# EAGLE schematic BLDC_controller_0 (EAGLE 9.4.1)
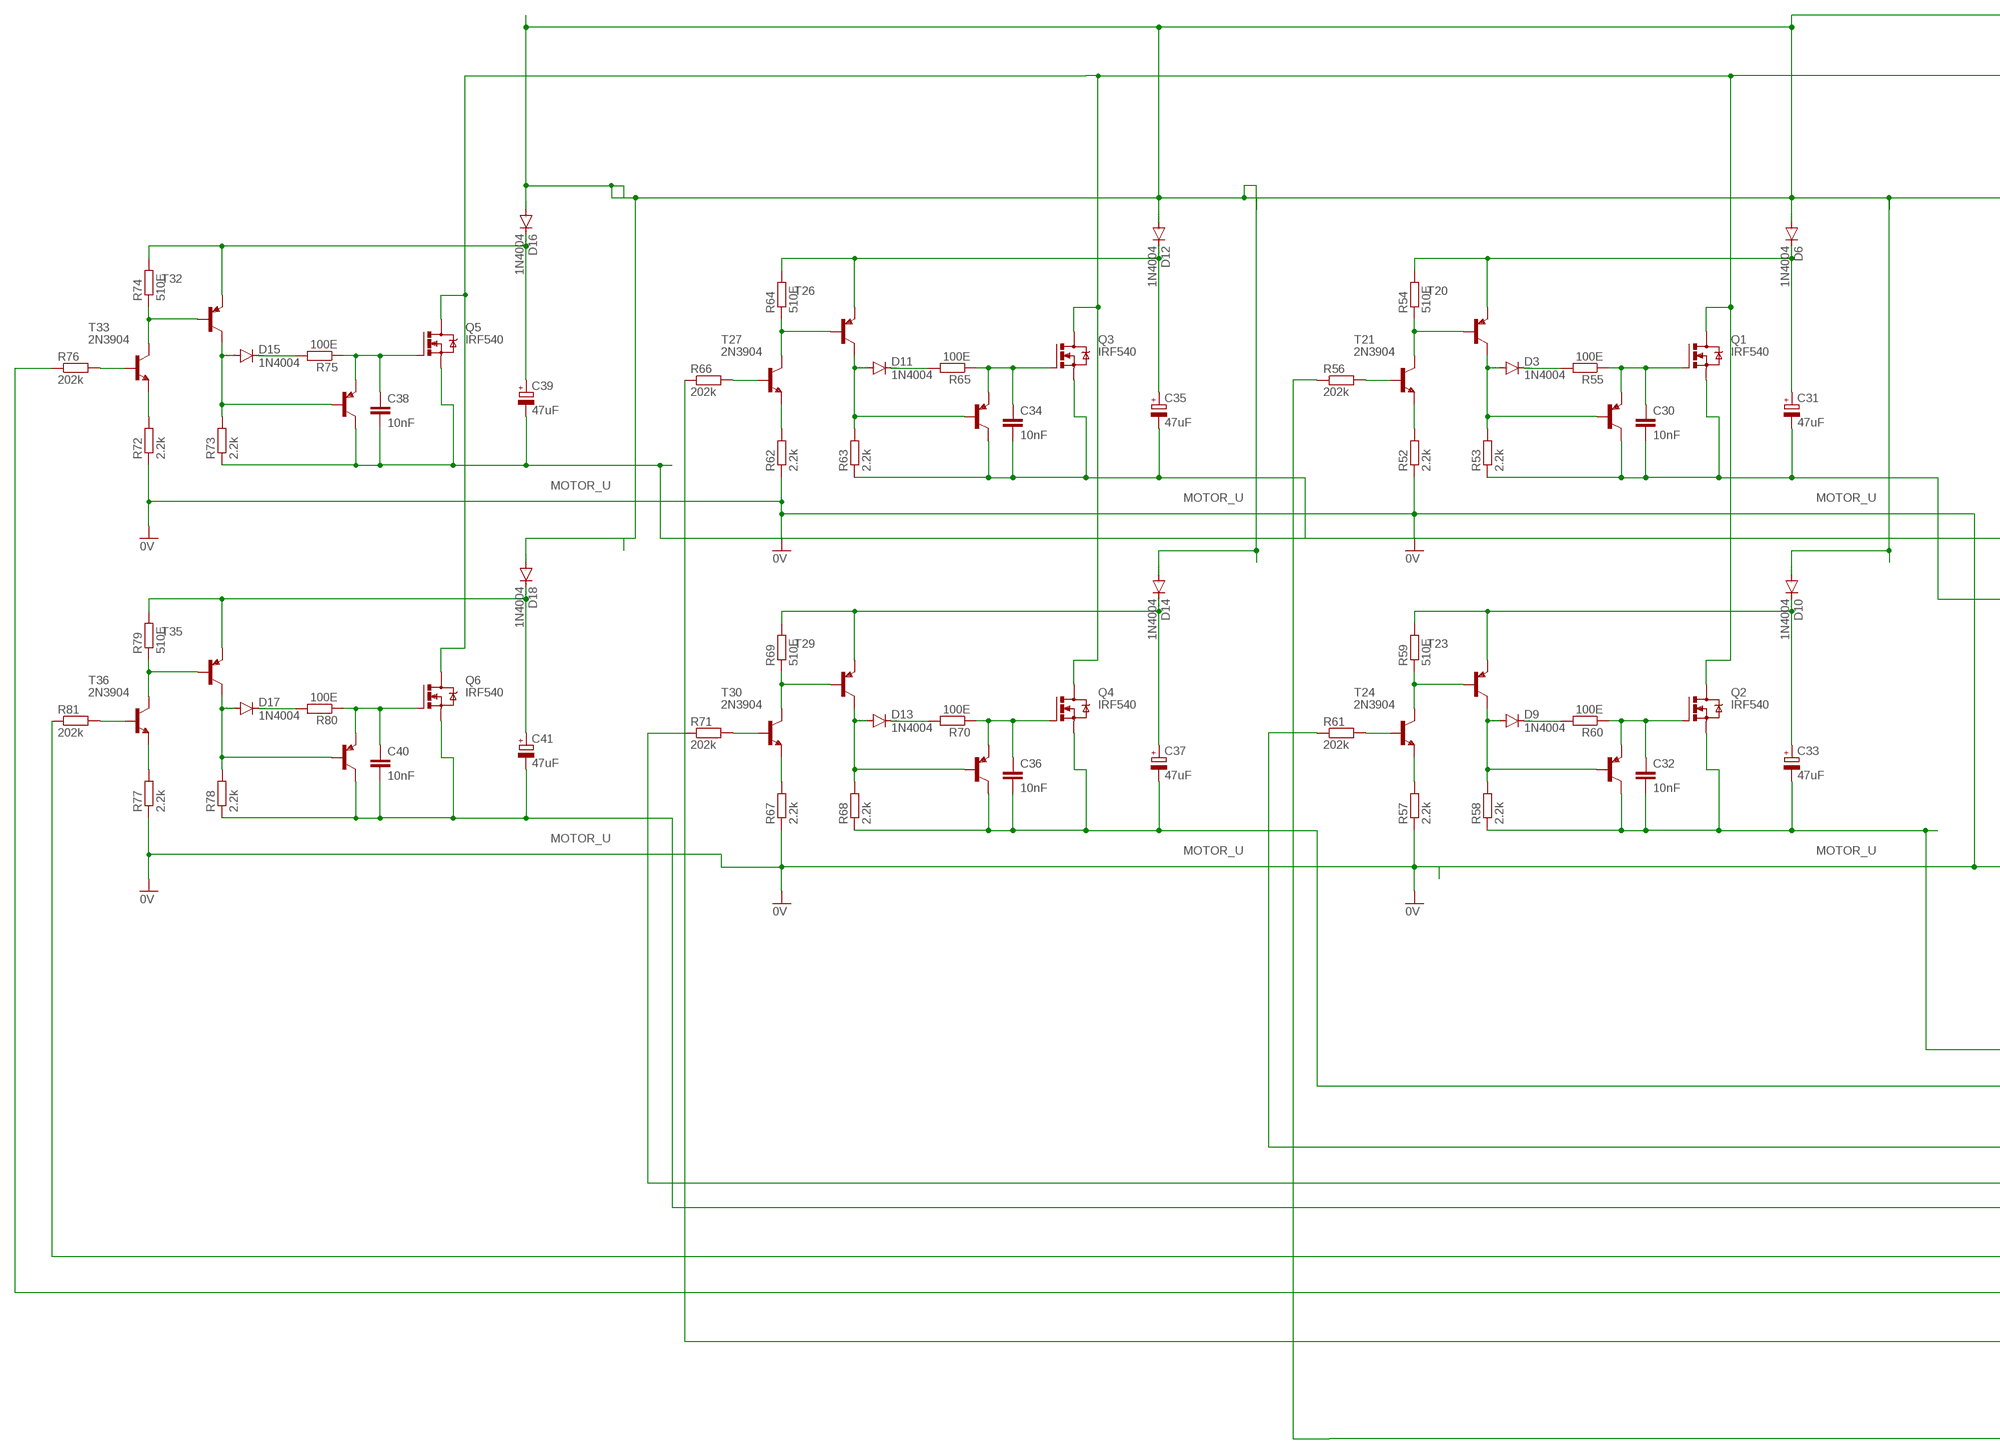
[diagram p0: schematic, sheet 1, part 1 of 3]
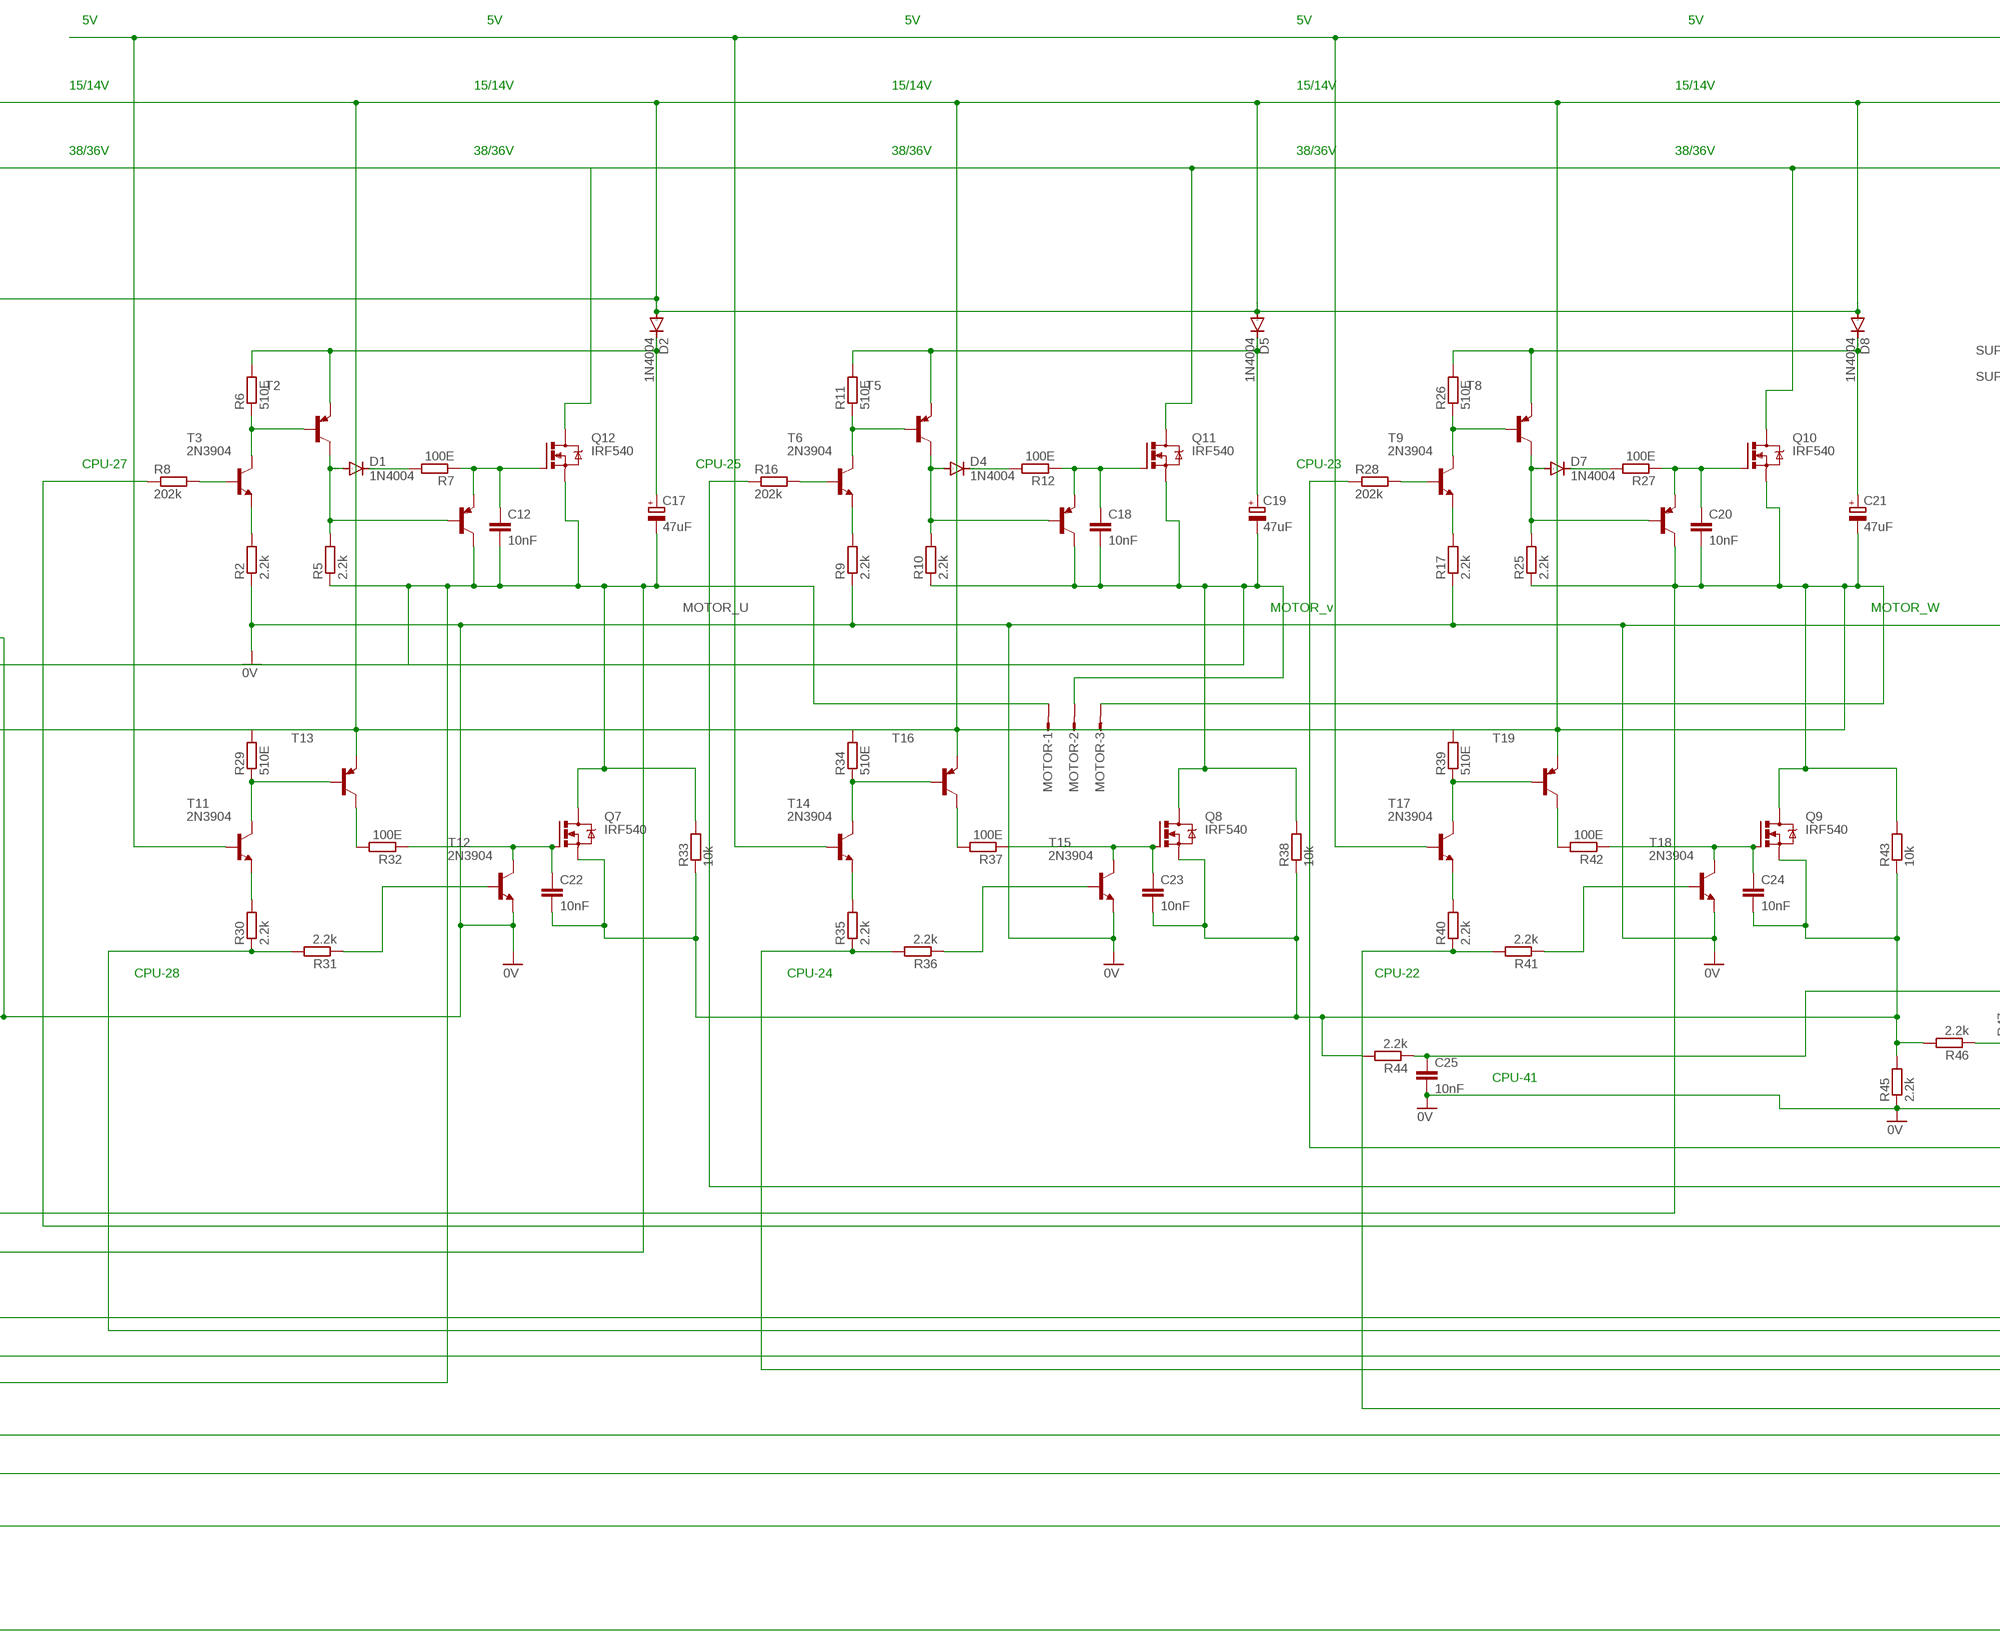
[diagram p1: schematic, sheet 1, part 2 of 3]
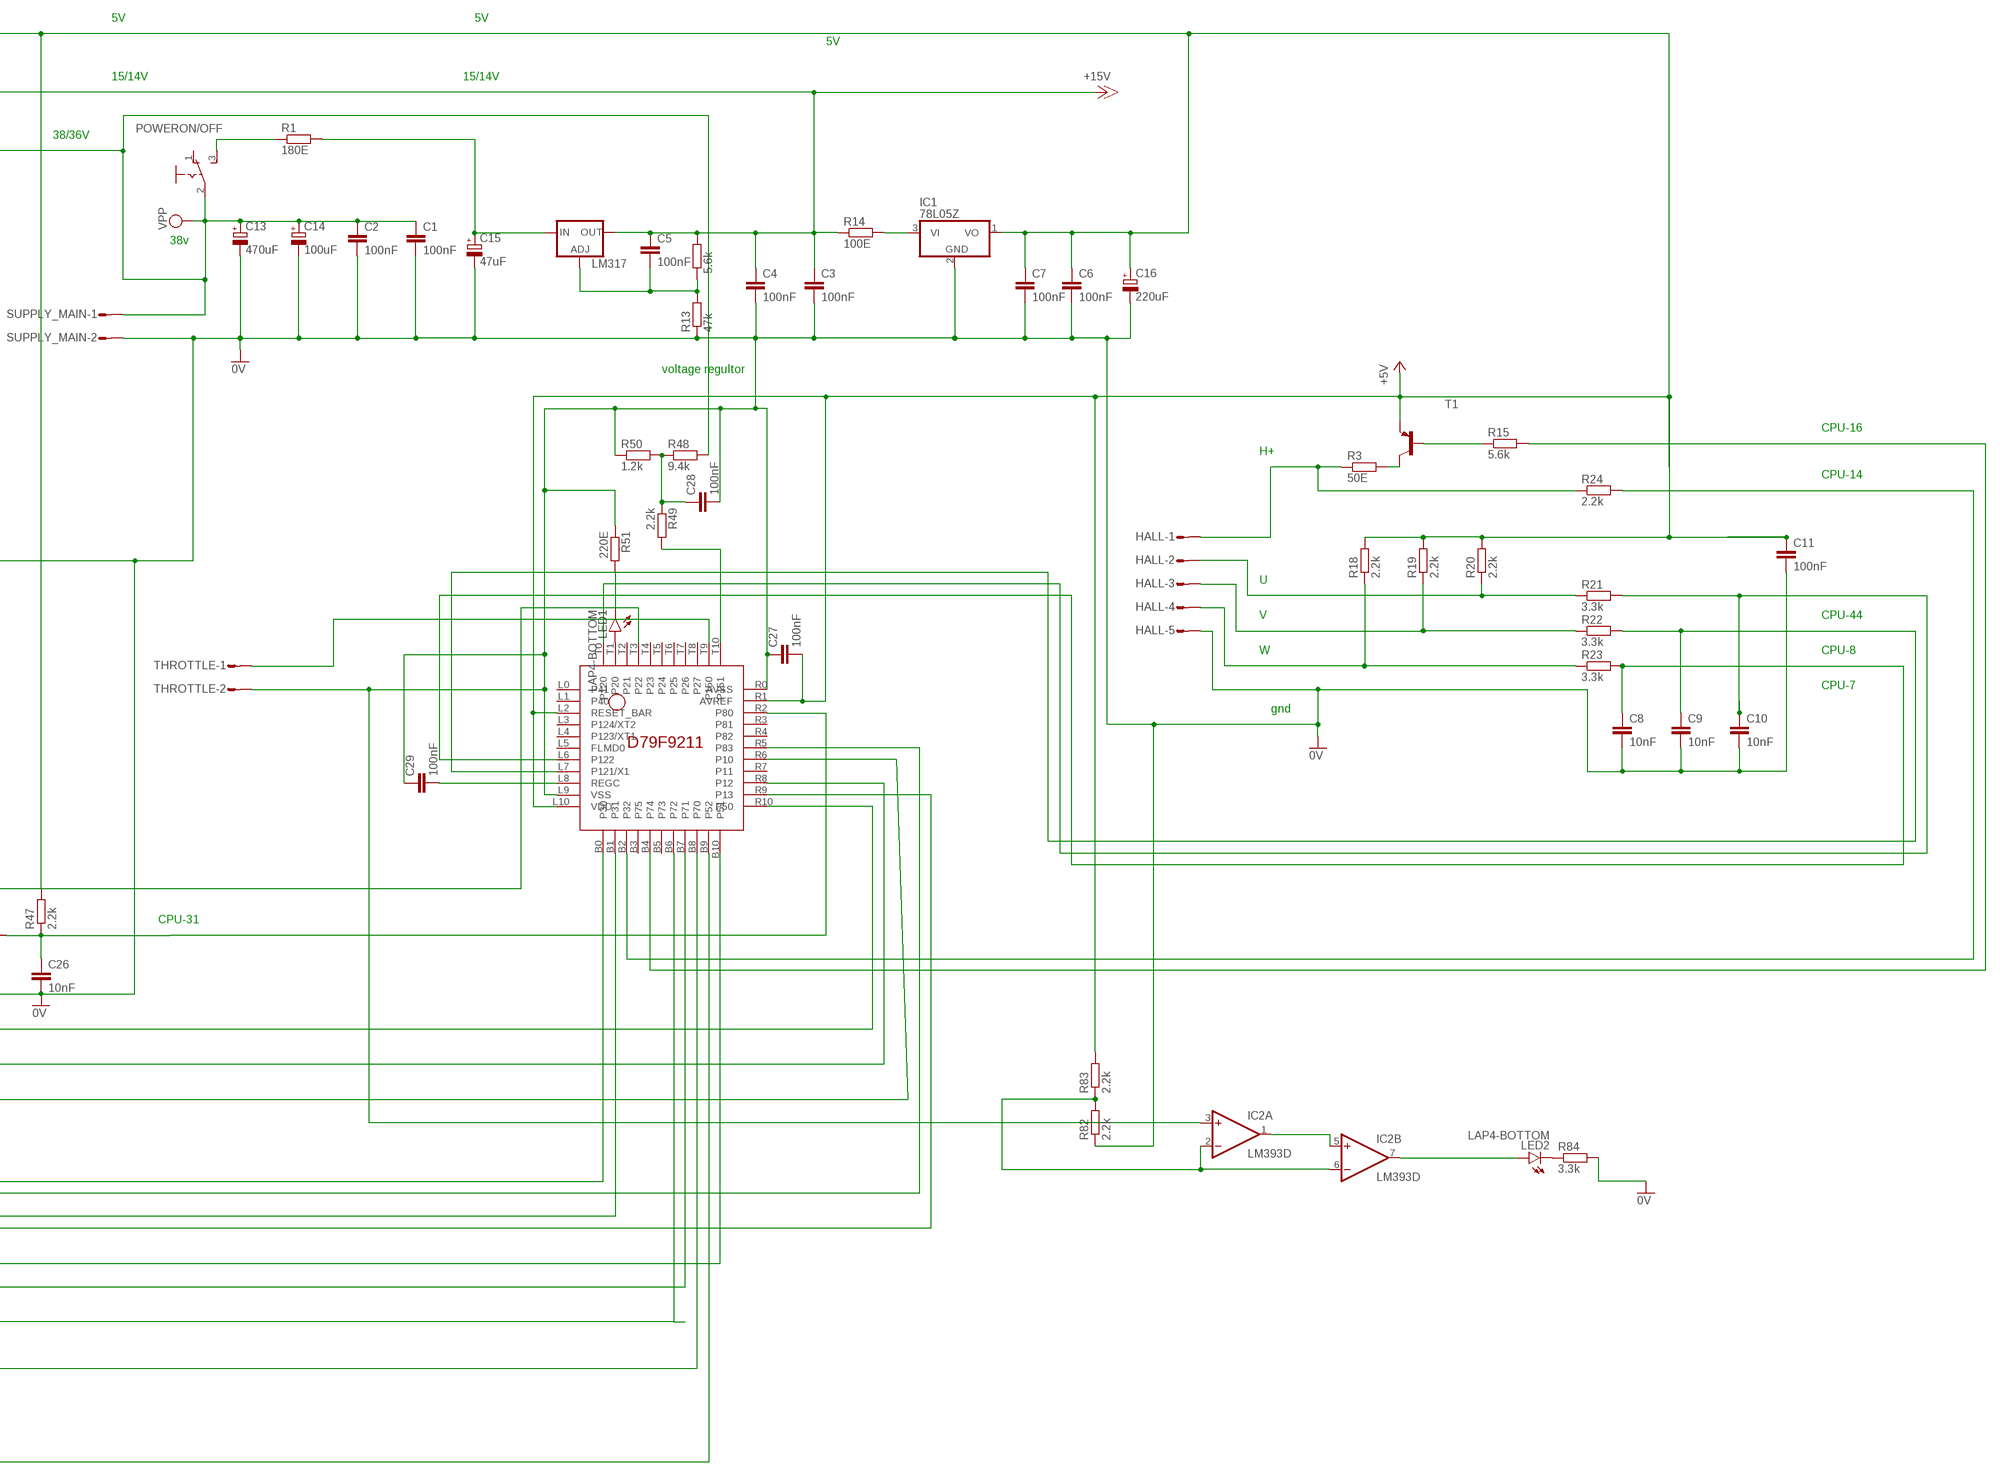
[diagram p2: schematic, sheet 1, part 3 of 3]

## Parts
C1  100nF  C-EU025-024X044  [C025-024X044]
C2  100nF  C-EU025-024X044  [C025-024X044]
C3  100nF  C-EU025-024X044  [C025-024X044]
C4  100nF  C-EU025-024X044  [C025-024X044]
C5  100nF  C-EU025-024X044  [C025-024X044]
C6  100nF  C-EU025-024X044  [C025-024X044]
C7  100nF  C-EU025-024X044  [C025-024X044]
C8  10nF  C-EU025-024X044  [C025-024X044]
C9  10nF  C-EU025-024X044  [C025-024X044]
C10  10nF  C-EU025-024X044  [C025-024X044]
C11  100nF  C-EU025-024X044  [C025-024X044]
C12  10nF  C-EU025-024X044  [C025-024X044]
C13  470uF  CPOL-EUE5-10.5  [E5-10,5]
C14  100uF  CPOL-EUE5-10.5  [E5-10,5]
C15  47uF  CPOL-EUE5-10.5  [E5-10,5]
C16  220uF  CPOL-EUE5-10.5  [E5-10,5]
C17  47uF  CPOL-EUE5-10.5  [E5-10,5]
C18  10nF  C-EU025-024X044  [C025-024X044]
C19  47uF  CPOL-EUE5-10.5  [E5-10,5]
C20  10nF  C-EU025-024X044  [C025-024X044]
C21  47uF  CPOL-EUE5-10.5  [E5-10,5]
C22  10nF  C-EU025-024X044  [C025-024X044]
C23  10nF  C-EU025-024X044  [C025-024X044]
C24  10nF  C-EU025-024X044  [C025-024X044]
C25  10nF  C-EU025-024X044  [C025-024X044]
C26  10nF  C-EU025-024X044  [C025-024X044]
C27  100nF  C-EU025-024X044  [C025-024X044]
C28  100nF  C-EU025-024X044  [C025-024X044]
C29  100nF  C-EU025-024X044  [C025-024X044]
C30  10nF  C-EU025-024X044  [C025-024X044]
C31  47uF  CPOL-EUE5-10.5  [E5-10,5]
C32  10nF  C-EU025-024X044  [C025-024X044]
C33  47uF  CPOL-EUE5-10.5  [E5-10,5]
C34  10nF  C-EU025-024X044  [C025-024X044]
C35  47uF  CPOL-EUE5-10.5  [E5-10,5]
C36  10nF  C-EU025-024X044  [C025-024X044]
C37  47uF  CPOL-EUE5-10.5  [E5-10,5]
C38  10nF  C-EU025-024X044  [C025-024X044]
C39  47uF  CPOL-EUE5-10.5  [E5-10,5]
C40  10nF  C-EU025-024X044  [C025-024X044]
C41  47uF  CPOL-EUE5-10.5  [E5-10,5]
D1  1N4004  [DO41-10]
D2  1N4004  [DO41-10]
D3  1N4004  [DO41-10]
D4  1N4004  [DO41-10]
D5  1N4004  [DO41-10]
D6  1N4004  [DO41-10]
D7  1N4004  [DO41-10]
D8  1N4004  [DO41-10]
D9  1N4004  [DO41-10]
D10  1N4004  [DO41-10]
D11  1N4004  [DO41-10]
D12  1N4004  [DO41-10]
D13  1N4004  [DO41-10]
D14  1N4004  [DO41-10]
D15  1N4004  [DO41-10]
D16  1N4004  [DO41-10]
D17  1N4004  [DO41-10]
D18  1N4004  [DO41-10]
HALL  S05P  [S05P]
IC1  78L05Z  [TO92]
IC2  LM393D  [SO08]
LED1  LAP4-BOTTOM  [P47F-BOTTOM]
LED2  LAP4-BOTTOM  [P47F-BOTTOM]
LM317  LM317TL  [317TL]
MOTOR  S03P  [S03P]
POWERON/OFF  255SB  [255SB]
Q1  IRF540  [TO220BV]
Q2  IRF540  [TO220BV]
Q3  IRF540  [TO220BV]
Q4  IRF540  [TO220BV]
Q5  IRF540  [TO220BV]
Q6  IRF540  [TO220BV]
Q7  IRF540  [TO220BV]
Q8  IRF540  [TO220BV]
Q9  IRF540  [TO220BV]
Q10  IRF540  [TO220BV]
Q11  IRF540  [TO220BV]
Q12  IRF540  [TO220BV]
R1  180E  R-EU_0204/5  [0204/5]
R2  2.2k  R-EU_0204/5  [0204/5]
R3  50E  R-EU_0204/5  [0204/5]
R4  5.6k  R-EU_0204/5  [0204/5]
R5  2.2k  R-EU_0204/5  [0204/5]
R6  510E  R-EU_0204/5  [0204/5]
R7  100E  R-EU_0204/5  [0204/5]
R8  202k  R-EU_0204/5  [0204/5]
R9  2.2k  R-EU_0204/5  [0204/5]
R10  2.2k  R-EU_0204/5  [0204/5]
R11  510E  R-EU_0204/5  [0204/5]
R12  100E  R-EU_0204/5  [0204/5]
R13  47k  R-EU_0204/5  [0204/5]
R14  100E  R-EU_0204/5  [0204/5]
R15  5.6k  R-EU_0204/5  [0204/5]
R16  202k  R-EU_0204/5  [0204/5]
R17  2.2k  R-EU_0204/5  [0204/5]
R18  2.2k  R-EU_0204/5  [0204/5]
R19  2.2k  R-EU_0204/5  [0204/5]
R20  2.2k  R-EU_0204/5  [0204/5]
R21  3.3k  R-EU_0204/5  [0204/5]
R22  3.3k  R-EU_0204/5  [0204/5]
R23  3.3k  R-EU_0204/5  [0204/5]
R24  2.2k  R-EU_0204/5  [0204/5]
R25  2.2k  R-EU_0204/5  [0204/5]
R26  510E  R-EU_0204/5  [0204/5]
R27  100E  R-EU_0204/5  [0204/5]
R28  202k  R-EU_0204/5  [0204/5]
R29  510E  R-EU_0204/5  [0204/5]
R30  2.2k  R-EU_0204/5  [0204/5]
R31  2.2k  R-EU_0204/5  [0204/5]
R32  100E  R-EU_0204/5  [0204/5]
R33  10k  R-EU_0204/5  [0204/5]
R34  510E  R-EU_0204/5  [0204/5]
R35  2.2k  R-EU_0204/5  [0204/5]
R36  2.2k  R-EU_0204/5  [0204/5]
R37  100E  R-EU_0204/5  [0204/5]
R38  10k  R-EU_0204/5  [0204/5]
R39  510E  R-EU_0204/5  [0204/5]
R40  2.2k  R-EU_0204/5  [0204/5]
R41  2.2k  R-EU_0204/5  [0204/5]
R42  100E  R-EU_0204/5  [0204/5]
R43  10k  R-EU_0204/5  [0204/5]
R44  2.2k  R-EU_0204/5  [0204/5]
R45  2.2k  R-EU_0204/5  [0204/5]
R46  2.2k  R-EU_0204/5  [0204/5]
R47  2.2k  R-EU_0204/5  [0204/5]
R48  9.4k  R-EU_0204/5  [0204/5]
R49  2.2k  R-EU_0204/5  [0204/5]
R50  1.2k  R-EU_0204/5  [0204/5]
R51  220E  R-EU_0204/5  [0204/5]
R52  2.2k  R-EU_0204/5  [0204/5]
R53  2.2k  R-EU_0204/5  [0204/5]
R54  510E  R-EU_0204/5  [0204/5]
R55  100E  R-EU_0204/5  [0204/5]
R56  202k  R-EU_0204/5  [0204/5]
R57  2.2k  R-EU_0204/5  [0204/5]
R58  2.2k  R-EU_0204/5  [0204/5]
R59  510E  R-EU_0204/5  [0204/5]
R60  100E  R-EU_0204/5  [0204/5]
R61  202k  R-EU_0204/5  [0204/5]
R62  2.2k  R-EU_0204/5  [0204/5]
R63  2.2k  R-EU_0204/5  [0204/5]
R64  510E  R-EU_0204/5  [0204/5]
R65  100E  R-EU_0204/5  [0204/5]
R66  202k  R-EU_0204/5  [0204/5]
R67  2.2k  R-EU_0204/5  [0204/5]
R68  2.2k  R-EU_0204/5  [0204/5]
R69  510E  R-EU_0204/5  [0204/5]
R70  100E  R-EU_0204/5  [0204/5]
R71  202k  R-EU_0204/5  [0204/5]
R72  2.2k  R-EU_0204/5  [0204/5]
R73  2.2k  R-EU_0204/5  [0204/5]
R74  510E  R-EU_0204/5  [0204/5]
R75  100E  R-EU_0204/5  [0204/5]
R76  202k  R-EU_0204/5  [0204/5]
R77  2.2k  R-EU_0204/5  [0204/5]
R78  2.2k  R-EU_0204/5  [0204/5]
R79  510E  R-EU_0204/5  [0204/5]
R80  100E  R-EU_0204/5  [0204/5]
R81  202k  R-EU_0204/5  [0204/5]
R82  2.2k  R-EU_0204/5  [0204/5]
R83  2.2k  R-EU_0204/5  [0204/5]
R84  3.3k  R-EU_0204/5  [0204/5]
SUPPLY_MAIN  S02P  [S02P]
T1  -PNP-TO92  [TO92]
T2  2N3906-PNP-TO92-EBC  [TO92-EBC]
T3  2N3904  [TO92]
T4  2N3906-PNP-TO92-EBC  [TO92-EBC]
T5  2N3906-PNP-TO92-EBC  [TO92-EBC]
T6  2N3904  [TO92]
T7  2N3906-PNP-TO92-EBC  [TO92-EBC]
T8  2N3906-PNP-TO92-EBC  [TO92-EBC]
T9  2N3904  [TO92]
T10  2N3906-PNP-TO92-EBC  [TO92-EBC]
T11  2N3904  [TO92]
T12  2N3904  [TO92]
T13  2N3906-PNP-TO92-EBC  [TO92-EBC]
T14  2N3904  [TO92]
T15  2N3904  [TO92]
T16  2N3906-PNP-TO92-EBC  [TO92-EBC]
T17  2N3904  [TO92]
T18  2N3904  [TO92]
T19  2N3906-PNP-TO92-EBC  [TO92-EBC]
T20  2N3906-PNP-TO92-EBC  [TO92-EBC]
T21  2N3904  [TO92]
T22  2N3906-PNP-TO92-EBC  [TO92-EBC]
T23  2N3906-PNP-TO92-EBC  [TO92-EBC]
T24  2N3904  [TO92]
T25  2N3906-PNP-TO92-EBC  [TO92-EBC]
T26  2N3906-PNP-TO92-EBC  [TO92-EBC]
T27  2N3904  [TO92]
T28  2N3906-PNP-TO92-EBC  [TO92-EBC]
T29  2N3906-PNP-TO92-EBC  [TO92-EBC]
T30  2N3904  [TO92]
T31  2N3906-PNP-TO92-EBC  [TO92-EBC]
T32  2N3906-PNP-TO92-EBC  [TO92-EBC]
T33  2N3904  [TO92]
T34  2N3906-PNP-TO92-EBC  [TO92-EBC]
T35  2N3906-PNP-TO92-EBC  [TO92-EBC]
T36  2N3904  [TO92]
T37  2N3906-PNP-TO92-EBC  [TO92-EBC]
THROTTLE  S02P  [S02P]
U$1  D79F9211DF9F9211  [D79F9211]

## Nets
0V: C1.2 C2.2 C3.2 C4.2 C6.2 C7.2 C8.2 C9.2 C10.2 C11.2 C13.- C14.- C15.- C16.- C25.2 C26.2 C27.1 C28.2 C29.1 HALL.5 IC1.2(GND) IC2.3(A:+IN) R2.1 R9.1 R13.1 R17.1 R45.1 R50.1 R51.1 R52.1 R57.1 R62.1 R67.1 R72.1 R77.1 R82.1 R84.2 SUPPLY_MAIN.2 T12.3(E) T15.3(E) T18.3(E) THROTTLE.2 U$1.L9(VSS) U$1.R0(AVSS)
+5V: C6.1 C7.1 C11.1 C16.+ C27.2 IC1.1(VO) R18.2 R19.2 R20.2 R47.2 R83.2 T1.1(E) T11.2(B) T14.2(B) T17.2(B) U$1.L2(RESET_BAR) U$1.L10(VDD) U$1.R1(AVREF)
+15V: C3.1 C4.1 C5.1 D2.A D5.A D6.A D8.A D10.A D12.A D14.A D16.A D18.A LM317.2(OUT) R4.2 R14.1 R29.2 R34.2 R39.2 T13.E T16.E T19.E
MOTOR_U: C12.2 C17.- C18.2 C19.- C20.2 C21.- C30.2 C31.- C32.2 C33.- C34.2 C35.- C36.2 C37.- C38.2 C39.- C40.2 C41.- MOTOR.1 MOTOR.2 MOTOR.3 Q1.S Q2.S Q3.S Q4.S Q5.S Q6.S Q7.D Q8.D Q9.D Q10.S Q11.S Q12.S R5.1 R10.1 R25.1 R33.2 R38.2 R43.2 R53.1 R58.1 R63.1 R68.1 R73.1 R78.1 T4.C T7.C T10.C T22.C T25.C T28.C T31.C T34.C T37.C
N$1: R30.2 T11.3(E)
N$2: C15.+ LM317.3(IN) R1.2
N$3: HALL.2 R20.1 R21.1
N$4: C5.2 LM317.1(ADJ) R4.1 R13.2
N$5: POWERON/OFF.3(S) R1.1
N$6: IC1.3(VI) R14.2
N$7: R35.2 T14.3(E)
N$8: HALL.3 R19.1 R22.1
N$9: HALL.4 R18.1 R23.1
N$10: R2.2 T3.3(E)
N$11: C9.1 R22.2 U$1.L7(P121/X1)
N$12: C8.1 R23.2 U$1.L6(P122)
N$13: R3.2 T1.3(C)
N$14: HALL.1 R3.1 R24.1
N$15: R24.2 U$1.B2(P32)
N$16: R15.1 T1.2(B)
N$17: R15.2 U$1.B4(P74)
N$18: C10.1 R21.2 U$1.T0(P120)
N$19: R57.2 T24.3(E)
N$20: R6.1 T2.B T3.1(C)
N$21: R8.2 T3.2(B)
N$22: D1.A R5.2 T2.C T4.B
N$23: D1.C R7.2
N$24: C12.1 Q12.G R7.1 T4.E
N$25: C17.+ D2.C R6.2 T2.E
N$27: R9.2 T6.3(E)
N$28: R32.2 T13.C
N$29: R11.1 T5.B T6.1(C)
N$30: C28.1 R48.1 R49.1 R50.2
N$31: R16.2 T6.2(B)
N$32: D4.A R10.2 T5.C T7.B
N$33: D4.C R12.2
N$34: C18.1 Q11.G R12.1 T7.E
N$35: C19.+ D5.C R11.2 T5.E
N$36: R40.2 T17.3(E)
N$37: R16.1 U$1.R8(P12)
N$39: R17.2 T9.3(E)
N$40: R26.1 T8.B T9.1(C)
N$41: R28.2 T9.2(B)
N$42: D7.A R25.2 T8.C T10.B
N$43: D7.C R27.2
N$44: C20.1 Q10.G R27.1 T10.E
N$45: C21.+ D8.C R26.2 T8.E
N$46: C22.1 Q7.G R32.1 T12.1(C)
N$47: R28.1 U$1.R10(P50)
N$49: R29.1 T11.1(C) T13.B
N$50: R37.2 T16.C
N$51: R30.1 R31.2 U$1.R5(P83)
N$52: R31.1 T12.2(B)
N$53: C25.1 LED1.C R44.1 U$1.T3(P22)
N$54: R42.2 T19.C
N$55: C23.1 Q8.G R37.1 T15.1(C)
N$56: R34.1 T14.1(C) T16.B
N$57: R35.1 R36.2 U$1.R9(P13)
N$58: R36.1 T15.2(B)
N$59: C22.2 C23.2 C24.2 Q7.S Q8.S Q9.S R33.1 R38.1 R43.1 R44.2 R45.2 R46.2
N$60: C26.1 R46.1 R47.1 U$1.R2(P80)
N$61: C24.1 Q9.G R42.1 T18.1(C)
N$62: R39.1 T17.1(C) T19.B
N$63: R40.1 R41.2 U$1.B10(P51)
N$64: R41.1 T18.2(B)
N$65: R49.2 U$1.T10(P151)
N$66: LED1.A U$1.T1(P20)
N$67: R51.2
N$68: C29.2 U$1.L8(REGC)
N$69: R52.2 T21.3(E)
N$70: R54.1 T20.B T21.1(C)
N$71: R56.2 T21.2(B)
N$72: D3.A R53.2 T20.C T22.B
N$73: D3.C R55.2
N$74: C30.1 Q1.G R55.1 T22.E
N$75: C31.+ D6.C R54.2 T20.E
N$77: R8.1 U$1.R6(P10)
N$78: R59.1 T23.B T24.1(C)
N$79: R61.2 T24.2(B)
N$80: D9.A R58.2 T23.C T25.B
N$81: D9.C R60.2
N$82: C32.1 Q2.G R60.1 T25.E
N$83: C33.+ D10.C R59.2 T23.E
N$85: R62.2 T27.3(E)
N$86: R64.1 T26.B T27.1(C)
N$87: R66.2 T27.2(B)
N$88: D11.A R63.2 T26.C T28.B
N$89: D11.C R65.2
N$90: C34.1 Q3.G R65.1 T28.E
N$91: C35.+ D12.C R64.2 T26.E
N$93: R67.2 T30.3(E)
N$94: R69.1 T29.B T30.1(C)
N$95: R71.2 T30.2(B)
N$96: D13.A R68.2 T29.C T31.B
N$97: D13.C R70.2
N$98: C36.1 Q4.G R70.1 T31.E
N$99: C37.+ D14.C R69.2 T29.E
N$101: R72.2 T33.3(E)
N$102: R74.1 T32.B T33.1(C)
N$103: R76.2 T33.2(B)
N$104: D15.A R73.2 T32.C T34.B
N$105: D15.C R75.2
N$106: C38.1 Q5.G R75.1 T34.E
N$107: C39.+ D16.C R74.2 T32.E
N$109: R77.2 T36.3(E)
N$110: R79.1 T35.B T36.1(C)
N$111: R81.2 T36.2(B)
N$112: D17.A R78.2 T35.C T37.B
N$113: D17.C R80.2
N$114: C40.1 Q6.G R80.1 T37.E
N$115: C41.+ D18.C R79.2 T35.E
N$117: R61.1 U$1.B0(P30)
N$118: R71.1 U$1.B1(P31)
N$119: R81.1 U$1.B7(P71)
N$120: R76.1 U$1.B6(P72)
N$121: R66.1 U$1.B8(P70)
N$122: R56.1 U$1.B9(P52)
N$123: IC2.1(A:OUT) IC2.5(B:+IN)
N$124: IC2.2(A:-IN) IC2.6(B:-IN) R82.2 R83.1
N$125: LED2.C R84.1
N$126: IC2.7(B:OUT) LED2.A
VPP: C1.1 C2.1 C13.+ C14.+ POWERON/OFF.2(P) Q1.D Q2.D Q3.D Q4.D Q5.D Q6.D Q10.D Q11.D Q12.D R48.2 SUPPLY_MAIN.1
VPP1: THROTTLE.1 U$1.T9(P150)
Unconnected: POWERON/OFF.1(O) U$1.B3(P75) U$1.B5(P73) U$1.L0(P41) U$1.L1(P40) U$1.L3(P124/XT2) U$1.L4(P123/XT1) U$1.L5(FLMD0) U$1.R3(P81) U$1.R4(P82) U$1.R7(P11) U$1.T2(P21) U$1.T4(P23) U$1.T5(P24) U$1.T6(P25) U$1.T7(P26) U$1.T8(P27)

## Notes on the sheet
- 5V | 5V | 5V | 5V | 5V | 5V | 5V
- 5V
- 15/14V | 15/14V | 15/14V | 15/14V | 15/14V | 15/14V | 15/14V
- 38/36V | 38/36V | 38/36V | 38/36V | 38/36V | 38/36V
- 38v
- voltage regultor
- CPU-27 | CPU-25 | CPU-23
- CPU-16
- H+
- CPU-14
- MOTOR_v | MOTOR_W
- U
- V | CPU-44
- W | CPU-8
- CPU-7
- gnd
- CPU-28 | CPU-24 | CPU-22
- CPU-31
- CPU-41

## Power pins joined to a net without a drawn wire
V+: IC2.8(P:V+)
V-: IC2.4(P:V-)

## Library data of the parts
C1-C12 C18 C20 C22-C30 C32 C34 C36 C38 C40 = rcl:C-EU: CAPACITOR, European symbol; SPICEPREFIX: C
C13-C17 C19 C21 C31 C33 C35 C37 C39 C41 = rcl:CPOL-EU: POLARIZED CAPACITOR, European symbol; SPICEPREFIX: C
D1-D18 = diode:1N4004: DIODE general purpose rectifier, 1 A
HALL = con-amp-mt:S05P: AMP MT CONNECTOR; OC_FARNELL: unknown; OC_NEWARK: unknown
IC1 = linear:78*: Positive VOLTAGE REGULATOR Source: http://cache.national.com/ds/LM/LM78L05.pdf http://www.fairchildsemi.com/ds/LM/LM7805.pdf
IC2 = linear:LM393: COMPARATOR
LED1 LED2 = led:*P4: PointLED® Enhanced Thinfilm LED TOP & BOTTOM mount LS P47F, LR P47F, LA P47F, LY P47F, LT P4SG, LB P4SG, LW P4SG Source: http://catalog.osram-os.com .. LA_LR_LS_LY_P47F_Pb_free.pdf
LM317 = v-reg:LM317TL: VOLTAGE REGULATOR
MOTOR = con-amp-mt:S03P: AMP MT CONNECTOR; OC_FARNELL: unknown; OC_NEWARK: unknown
POWERON/OFF = switch:255SB: SLIDING SWITCH Distributor Buerklin, 11G810
Q1-Q12 = transistor-power:IRF540: HEXFET Power MOSFET
R1-R84 = rcl:R-EU_: RESISTOR, European symbol; SPICEPREFIX: R
SUPPLY_MAIN THROTTLE = con-amp-mt:S02P: AMP MT CONNECTOR; OC_FARNELL: unknown; OC_NEWARK: unknown
T1 = transistor:*-PNP-: PNP Transistror
T2 T4 T5 T7 T8 T10 T13 T16 T19 T20 T22 T23 T25 T26 T28 T29 T31 T32 T34 T35 T37 = transistor-neu-to92:*-PNP-: PNP Transistror
T3 T6 T9 T11 T12 T14 T15 T17 T18 T21 T24 T27 T30 T33 T36 = transistor:2N3904: NPN TRANSISTOR
U$1 = D79F9211:D79F9211